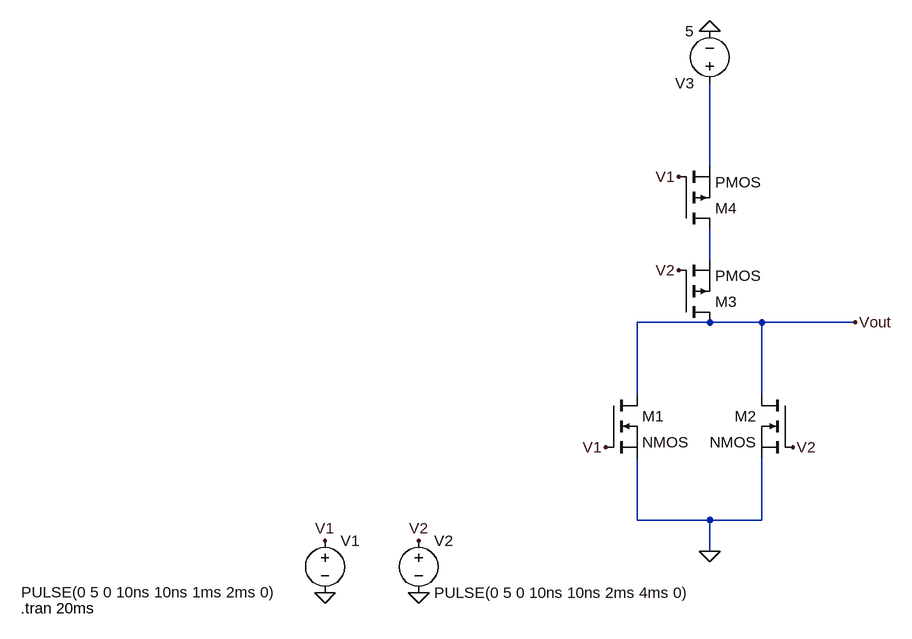
[diagram p0: schematic Draft9.asc]
Draft9.asc, the LTspice schematic file:
Version 4
SHEET 1 880 680
WIRE 96 -240 96 -368
WIRE 96 -96 96 -144
WIRE 96 0 -16 0
WIRE 176 0 96 0
WIRE 320 0 176 0
WIRE -16 112 -16 0
WIRE 176 112 176 0
WIRE -16 304 -16 208
WIRE 96 304 -16 304
WIRE 176 304 176 208
WIRE 176 304 96 304
WIRE 96 352 96 304
FLAG 96 352 0
FLAG -352 416 0
FLAG -496 416 0
FLAG 96 -448 0
FLAG -496 336 V1
FLAG -352 336 V2
FLAG -64 192 V1
FLAG 224 192 V2
FLAG 48 -224 V1
FLAG 48 -80 V2
FLAG 320 0 Vout
SYMBOL voltage -496 320 R0
WINDOW 3 -467 95 Left 2
WINDOW 123 0 0 Left 0
WINDOW 39 0 0 Left 0
SYMATTR InstName V1
SYMATTR Value PULSE(0 5 0 10ns 10ns 1ms 2ms 0)
SYMBOL voltage -352 320 R0
WINDOW 123 0 0 Left 0
WINDOW 39 0 0 Left 0
SYMATTR InstName V2
SYMATTR Value PULSE(0 5 0 10ns 10ns 2ms 4ms 0)
SYMBOL voltage 96 -352 R180
WINDOW 123 0 0 Left 0
WINDOW 39 0 0 Left 0
SYMATTR InstName V3
SYMATTR Value 5
SYMBOL nmos -64 112 R0
SYMATTR InstName M1
SYMBOL nmos 224 112 M0
SYMATTR InstName M2
SYMBOL pmos 48 0 M180
SYMATTR InstName M3
SYMBOL pmos 48 -144 M180
SYMATTR InstName M4
TEXT -964 440 Left 2 !.tran 20ms

The netlist it stands for:
* Draft9.asc
V1 V1 0 PULSE(0 5 0 10ns 10ns 1ms 2ms 0)
V2 V2 0 PULSE(0 5 0 10ns 10ns 2ms 4ms 0)
V3 N001 0 5
M1 Vout V1 0 0 NMOS
M2 Vout V2 0 0 NMOS
M3 Vout V2 N002 N002 PMOS
M4 N002 V1 N001 N001 PMOS
.model NMOS NMOS
.model PMOS PMOS
.lib standard.mos
.tran 20ms
.backanno
.end